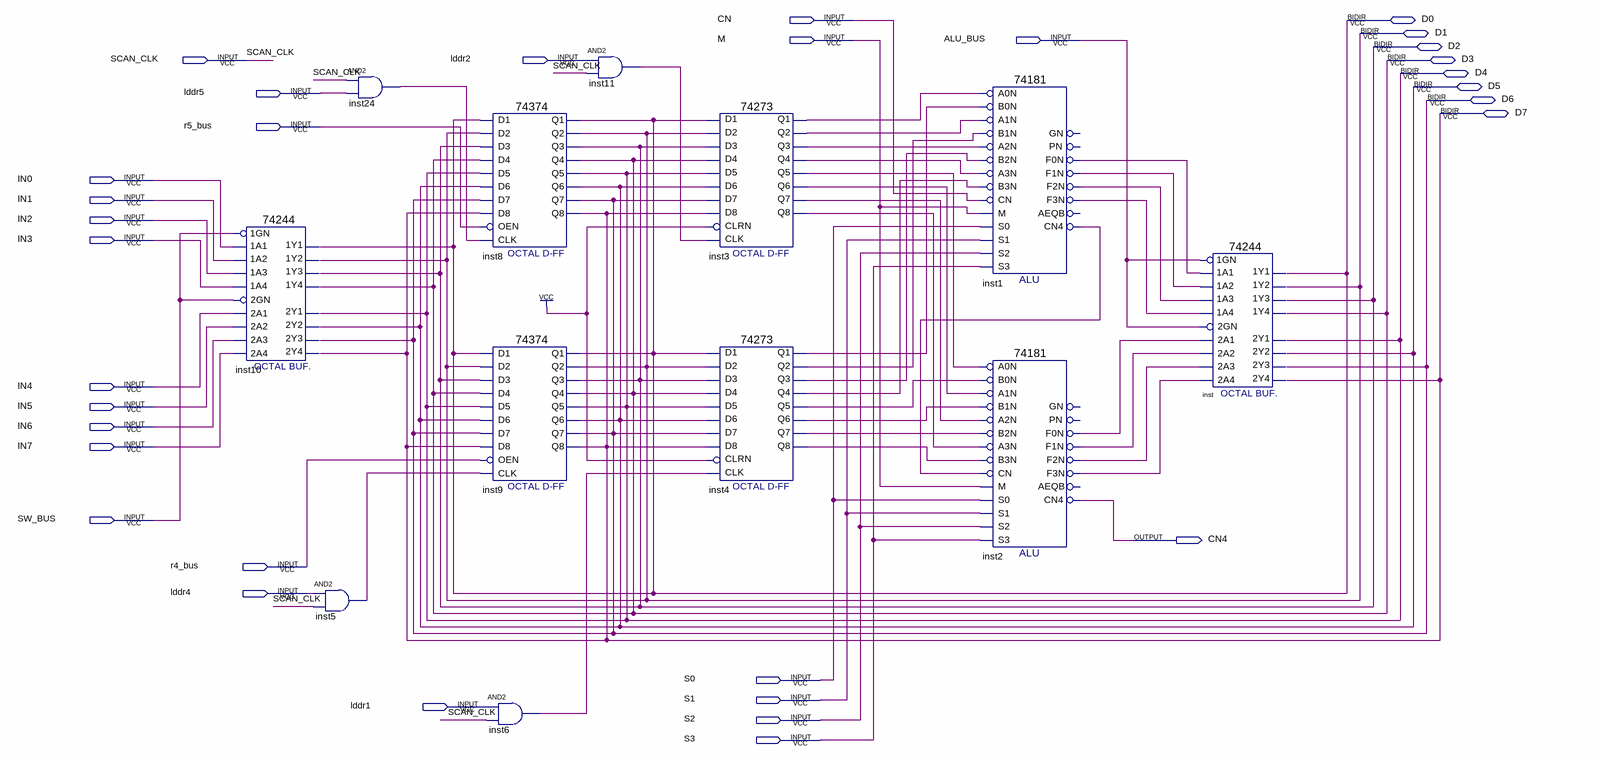
[diagram p0: schematic sheet]
// Quartus schematic exp_r_alu - 副本.bdf as structural Verilog: 12 symbols, 32 pins
module \exp_r_alu_-_副本  (
  input  CN,
  input  M,
  input  ALU_BUS,
  input  SCAN_CLK,
  input  lddr2,
  input  lddr5,
  input  r5_bus,
  input  IN0,
  input  IN1,
  input  IN2,
  input  IN3,
  input  IN4,
  input  IN5,
  input  IN6,
  input  IN7,
  input  SW_BUS,
  input  r4_bus,
  input  lddr4,
  input  S0,
  input  S1,
  input  lddr1,
  input  S2,
  input  S3,
  inout  D0,
  inout  D1,
  inout  D2,
  inout  D3,
  inout  D4,
  inout  D5,
  inout  D6,
  inout  D7,
  output CN4
);

  wire inst1_cn4, inst1_f0n, inst1_f1n, inst1_f2n, inst1_f3n, inst2_f0n, inst2_f1n, inst2_f2n, inst2_f3n,
       inst3_q1, inst3_q2, inst3_q3, inst3_q4, inst3_q5, inst3_q6, inst3_q7, inst3_q8, inst4_q1, inst4_q2,
       inst4_q3, inst4_q4, inst4_q5, inst4_q6, inst4_q7, inst4_q8, inst5_out, inst6_out, inst11_out,
       inst24_out;

  \74244  inst10 (
    .\1A2 (IN1), .\1A4 (IN3), .\1A1 (IN0), .\1A3 (IN2), .\1GN (SW_BUS), .\2A3 (IN6), .\2GN (SW_BUS),
    .\2A1 (IN4), .\2A4 (IN7), .\2A2 (IN5), .\1Y2 (D1), .\1Y4 (D3), .\2Y1 (D4), .\1Y1 (D0), .\2Y3 (D6),
    .\2Y4 (D7), .\1Y3 (D2), .\2Y2 (D5));
  and inst5 (inst5_out, lddr4, SCAN_CLK);
  and inst24 (inst24_out, SCAN_CLK, lddr5);
  \74374  inst8 (
    .D1(D0), .D2(D1), .D3(D2), .D4(D3), .D6(D5), .D5(D4), .OEN(r5_bus), .D8(D7), .D7(D6), .CLK(inst24_out),
    .Q2(D1), .Q3(D2), .Q5(D4), .Q4(D3), .Q6(D5), .Q7(D6), .Q8(D7), .Q1(D0));
  \74374  inst9 (
    .D1(D0), .D2(D1), .D3(D2), .D4(D3), .D6(D5), .D5(D4), .OEN(r4_bus), .D8(D7), .D7(D6), .CLK(inst5_out),
    .Q2(D1), .Q3(D2), .Q5(D4), .Q4(D3), .Q6(D5), .Q7(D6), .Q8(D7), .Q1(D0));
  and inst6 (inst6_out, lddr1, SCAN_CLK);
  and inst11 (inst11_out, lddr2, SCAN_CLK);
  \74273  inst3 (
    .D2(D1), .D3(D2), .D1(D0), .D4(D3), .D7(D6), .D6(D5), .D5(D4), .D8(D7), .CLK(inst11_out), .CLRN(1'b1),
    .Q4(inst3_q4), .Q1(inst3_q1), .Q2(inst3_q2), .Q3(inst3_q3), .Q6(inst3_q6), .Q5(inst3_q5), .Q7(inst3_q7),
    .Q8(inst3_q8));
  \74273  inst4 (
    .D2(D1), .D3(D2), .D1(D0), .D4(D3), .D7(D6), .D6(D5), .D5(D4), .D8(D7), .CLK(inst6_out), .CLRN(1'b1),
    .Q4(inst4_q4), .Q1(inst4_q1), .Q2(inst4_q2), .Q3(inst4_q3), .Q6(inst4_q6), .Q5(inst4_q5), .Q7(inst4_q7),
    .Q8(inst4_q8));
  \74181  inst1 (
    .B0N(inst4_q1), .A0N(inst3_q1), .A1N(inst3_q2), .B1N(inst4_q2), .A3N(inst3_q4), .B2N(inst4_q3),
    .A2N(inst3_q3), .M(M), .CN(CN), .B3N(inst4_q4), .S2(S2), .S1(S1), .S0(S0), .S3(S3), .F3N(inst1_f3n),
    .F1N(inst1_f1n), .F0N(inst1_f0n), .CN4(inst1_cn4), .F2N(inst1_f2n));  // open: PN, GN, AEQB
  \74181  inst2 (
    .B0N(inst4_q5), .A0N(inst3_q5), .A1N(inst3_q6), .B1N(inst4_q6), .A3N(inst3_q8), .B2N(inst4_q7),
    .A2N(inst3_q7), .M(M), .CN(inst1_cn4), .B3N(inst4_q8), .S2(S2), .S1(S1), .S0(S0), .S3(S3),
    .F3N(inst2_f3n), .F1N(inst2_f1n), .F0N(inst2_f0n), .CN4(CN4), .F2N(inst2_f2n));  // open: PN, GN, AEQB
  \74244  inst (
    .\1A2 (inst1_f1n), .\1A4 (inst1_f3n), .\1A1 (inst1_f0n), .\1A3 (inst1_f2n), .\1GN (ALU_BUS),
    .\2A3 (inst2_f2n), .\2GN (ALU_BUS), .\2A1 (inst2_f0n), .\2A4 (inst2_f3n), .\2A2 (inst2_f1n), .\1Y2 (D1),
    .\1Y4 (D3), .\2Y1 (D4), .\1Y1 (D0), .\2Y3 (D6), .\2Y4 (D7), .\1Y3 (D2), .\2Y2 (D5));
endmodule
